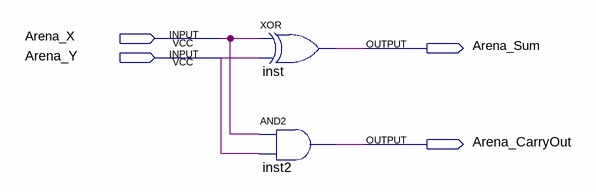
[diagram p0: schematic sheet]
// Quartus schematic Arena_HalfAdder.bdf as structural Verilog: 2 symbols, 4 pins
module Arena_HalfAdder (
  input  Arena_X,
  input  Arena_Y,
  output Arena_Sum,
  output Arena_CarryOut
);

  xor inst (Arena_Sum, Arena_X, Arena_Y);
  and inst2 (Arena_CarryOut, Arena_X, Arena_Y);
endmodule
